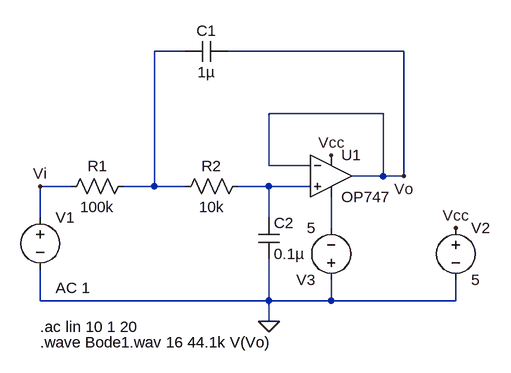
[diagram p0: schematic A1_1.asc]
A1_1.asc, the LTspice schematic file:
Version 4
SHEET 1 880 680
WIRE 64 -160 16 -160
WIRE 400 -160 128 -160
WIRE 368 -64 192 -64
WIRE 192 16 192 -64
WIRE 256 16 192 16
WIRE 368 32 368 -64
WIRE 368 32 320 32
WIRE 400 32 400 -160
WIRE 400 32 368 32
WIRE -112 48 -160 48
WIRE 16 48 16 -160
WIRE 16 48 -32 48
WIRE 64 48 16 48
WIRE 192 48 144 48
WIRE 256 48 192 48
WIRE -160 96 -160 48
WIRE 192 96 192 48
WIRE 288 112 288 64
WIRE -160 224 -160 176
WIRE 192 224 192 160
WIRE 192 224 -160 224
WIRE 288 224 288 192
WIRE 288 224 192 224
WIRE 480 224 480 192
WIRE 480 224 288 224
WIRE 192 256 192 224
FLAG 192 256 0
FLAG 480 112 Vcc
FLAG 288 0 Vcc
FLAG -160 48 Vi
FLAG 400 32 Vo
SYMBOL cap 176 96 R0
SYMATTR InstName C2
SYMATTR Value 0.1µ
SYMBOL cap 128 -176 R90
WINDOW 0 0 32 VBottom 2
WINDOW 3 32 32 VTop 2
SYMATTR InstName C1
SYMATTR Value 1µ
SYMBOL res -16 32 R90
WINDOW 0 0 56 VBottom 2
WINDOW 3 32 56 VTop 2
SYMATTR InstName R1
SYMATTR Value 100k
SYMBOL res 160 32 R90
WINDOW 0 0 56 VBottom 2
WINDOW 3 32 56 VTop 2
SYMATTR InstName R2
SYMATTR Value 10k
SYMBOL OpAmps\\OP747 288 -32 R0
SYMATTR InstName U1
SYMBOL voltage -160 80 R0
WINDOW 123 24 124 Left 2
WINDOW 39 0 0 Left 0
SYMATTR Value2 AC 1
SYMATTR InstName V1
SYMATTR Value ""
SYMBOL voltage 480 96 R0
WINDOW 123 0 0 Left 0
WINDOW 39 0 0 Left 0
SYMATTR InstName V2
SYMATTR Value 5
SYMBOL voltage 288 208 R180
WINDOW 123 0 0 Left 0
WINDOW 39 0 0 Left 0
SYMATTR InstName V3
SYMATTR Value 5
TEXT -160 264 Left 2 !.ac lin 10 1 20
TEXT -160 288 Left 2 !.wave Bode1.wav 16 44.1k V(Vo)

The netlist it stands for:
* A1_1.asc
C2 N002 0 0.1µ
C1 Vo N001 1µ
R1 N001 Vi 100k
R2 N002 N001 10k
XU1 N002 Vo Vcc N003 Vo OP747  ; pins In+ In- V+ V- OUT
V1 Vi 0 AC 1
V2 Vcc 0 5
V3 0 N003 5
.ac lin 10 1 20
.wave Bode1.wav 16 44.1k V(Vo)
.backanno
.end